# EAGLE schematic ukl-eagle (EAGLE 6.5.0)
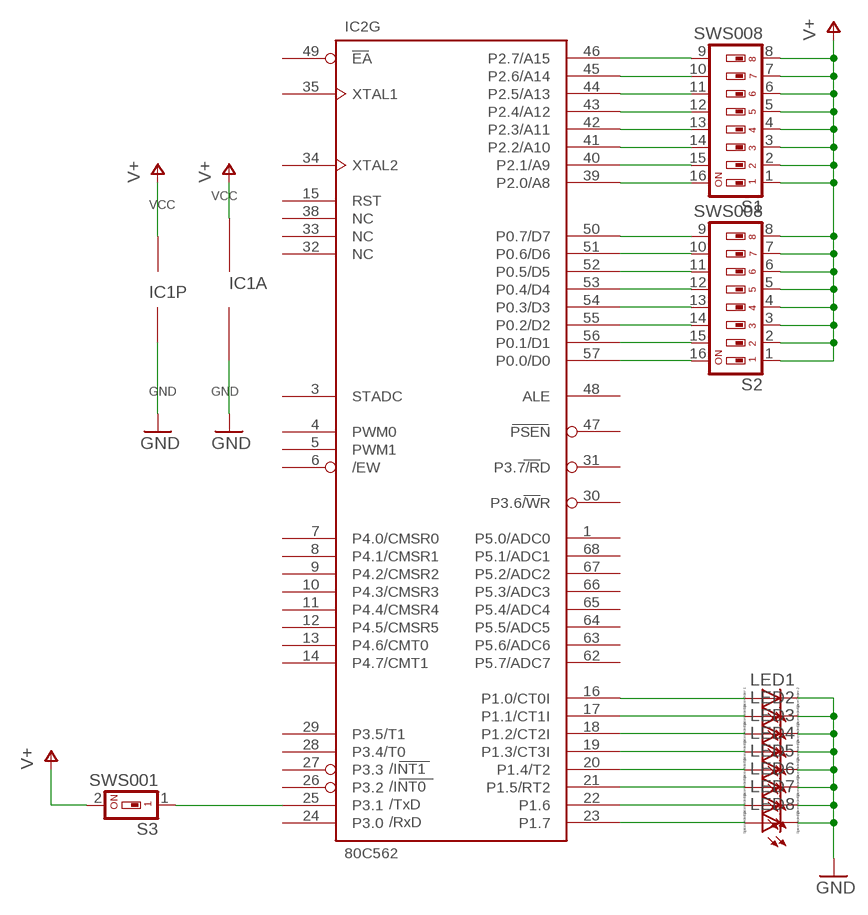
[diagram p0: schematic, sheet 1]

## Parts
IC1  80C576SMD  [PLCC44]
IC2  80C562  [PLCC-S68]
LED1  LED_E  [LED_1206]
LED2  LED_E  [LED_1206]
LED3  LED_E  [LED_1206]
LED4  LED_E  [LED_1206]
LED5  LED_E  [LED_1206]
LED6  LED_E  [LED_1206]
LED7  LED_E  [LED_1206]
LED8  LED_E  [LED_1206]
S1  SWS008  [SMS-008]
S2  SWS008  [SMS-008]
S3  SWS001  [SMS-001]

## Nets
GND: IC1.3(A:AGND) IC1.22(P:GND) LED1.C LED2.C LED3.C LED4.C LED5.C LED6.C LED7.C LED8.C
N$1: IC2.46(G:P2.7/A15) S1.9
N$2: IC2.45(G:P2.6/A14) S1.10
N$3: IC2.44(G:P2.5/A13) S1.11
N$4: IC2.43(G:P2.4/A12) S1.12
N$5: IC2.42(G:P2.3/A11) S1.13
N$6: IC2.41(G:P2.2/A10) S1.14
N$7: IC2.40(G:P2.1/A9) S1.15
N$8: IC2.39(G:P2.0/A8) S1.16
N$9: IC2.25(G:P3.1) S3.1
N$10: IC2.56(G:P0.1/D1) S2.15
N$11: IC2.51(G:P0.6/D6) S2.10
N$12: IC2.52(G:P0.5/D5) S2.11
N$13: IC2.53(G:P0.4/D4) S2.12
N$14: IC2.54(G:P0.3/D3) S2.13
N$15: IC2.55(G:P0.2/D2) S2.14
N$16: IC2.50(G:P0.7/D7) S2.9
N$17: IC2.57(G:P0.0/D0) S2.16
N$18: IC2.16(G:P1.0/CT0I) LED1.A
N$19: IC2.17(G:P1.1/CT1I) LED2.A
N$20: IC2.18(G:P1.2/CT2I) LED3.A
N$21: IC2.19(G:P1.3/CT3I) LED4.A
N$22: IC2.20(G:P1.4/T2) LED5.A
N$23: IC2.21(G:P1.5/RT2) LED6.A
N$24: IC2.22(G:P1.6) LED7.A
N$25: IC2.23(G:P1.7) LED8.A
V+: IC1.2(A:AVCC) IC1.44(P:VCC) S1.1 S1.2 S1.3 S1.4 S1.5 S1.6 S1.7 S1.8 S2.1 S2.2 S2.3 S2.4 S2.5 S2.6 S2.7 S2.8 S3.2
Unconnected: IC1.1(G:NC) IC1.4(G:P1.0) IC1.5(G:P1.1) IC1.6(G:P1.2) IC1.7(G:P1.3) IC1.8(G:P1.4) IC1.9(G:P1.5) IC1.10(G:RST) IC1.11(G:P3.0) IC1.12(G:NC) IC1.13(G:P3.1) IC1.14(G:P3.2) IC1.15(G:P3.3) IC1.16(G:P3.4/T0) IC1.17(G:P3.5/T1) IC1.18(G:P3.6/WR) IC1.19(G:P3.7/RD) IC1.20(G:XTAL2) IC1.21(G:XTAL1) IC1.23(G:NC) IC1.24(G:P2.0/A8) IC1.25(G:P2.1/A9) IC1.26(G:P2.2/A10) IC1.27(G:P2.3/A11) IC1.28(G:P2.4/A12) IC1.29(G:P2.5/A13) IC1.30(G:P2.6/A14) IC1.31(G:P2.7/A15) IC1.32(G:PSEN) IC1.33(G:ALE) IC1.34(G:NC) IC1.35(G:EA) IC1.36(G:P0.7/D7) IC1.37(G:P0.6/D6) IC1.38(G:P0.5/D5) IC1.39(G:P0.4/D4) IC1.40(G:P0.3/D3) IC1.41(G:P0.2/D2) IC1.42(G:P0.1/D1) IC1.43(G:P0.0/D0) IC2.1(G:P5.0/ADC0) IC2.3(G:STADC) IC2.4(G:PWM0) IC2.5(G:PWM1) IC2.6(G:/EW) IC2.7(G:P4.0/CMSR0) IC2.8(G:P4.1/CMSR1) IC2.9(G:P4.2/CMSR2) IC2.10(G:P4.3/CMSR3) IC2.11(G:P4.4/CMSR4) IC2.12(G:P4.5/CMSR5) IC2.13(G:P4.6/CMT0) IC2.14(G:P4.7/CMT1) IC2.15(G:RST) IC2.24(G:P3.0) IC2.26(G:P3.2) IC2.27(G:P3.3) IC2.28(G:P3.4/T0) IC2.29(G:P3.5/T1) IC2.30(G:P3.6/WR) IC2.31(G:P3.7/RD) IC2.32(G:NC) IC2.33(G:NC) IC2.34(G:XTAL2) IC2.35(G:XTAL1) IC2.38(G:NC) IC2.47(G:PSEN) IC2.48(G:ALE) IC2.49(G:EA) IC2.62(G:P5.7/ADC7) IC2.63(G:P5.6/ADC6) IC2.64(G:P5.5/ADC5) IC2.65(G:P5.4/ADC4) IC2.66(G:P5.3/ADC3) IC2.67(G:P5.2/ADC2) IC2.68(G:P5.1/ADC1)

## Power pins joined to a net without a drawn wire
AVDD: IC2.61(P:AVDD)
AVREF-: IC2.58(P:AVREF-)
AVSS: IC2.60(P:AVSS)
VDD: IC2.2(P:VDD)
VREF: IC2.59(P:VREF)
VSS: IC2.36(P:VSS) IC2.37(P:VSS)

## Library data of the parts
IC1 = micro-philips:80C576: 8051 -compatible 8-bit Microcontroller; OC_FARNELL: unknown; OC_NEWARK: unknown
IC2 = micro-philips:80C562: 8051-compatible 8bit Microcontroller; MPN: P80C562EBA/02,512; OC_FARNELL: 121198; OC_NEWARK: 70R8452
LED1-LED8 = eagle-ltspice:LED_E: LED Source: http://www.osram.convergy.de Source: www.luxeon.com Source: www.kingbright.com; SPICEMODEL: NONE; SPICEPREFIX: D; SPICETYPE: diode
S1 S2 = smd-special:SWS008: SMD Dip Switch 8 pol.
S3 = smd-special:SWS001: SMD Dip Switch 1 pol.